# Altium schematic sheet HandTieSchematic.SchDoc
size A4
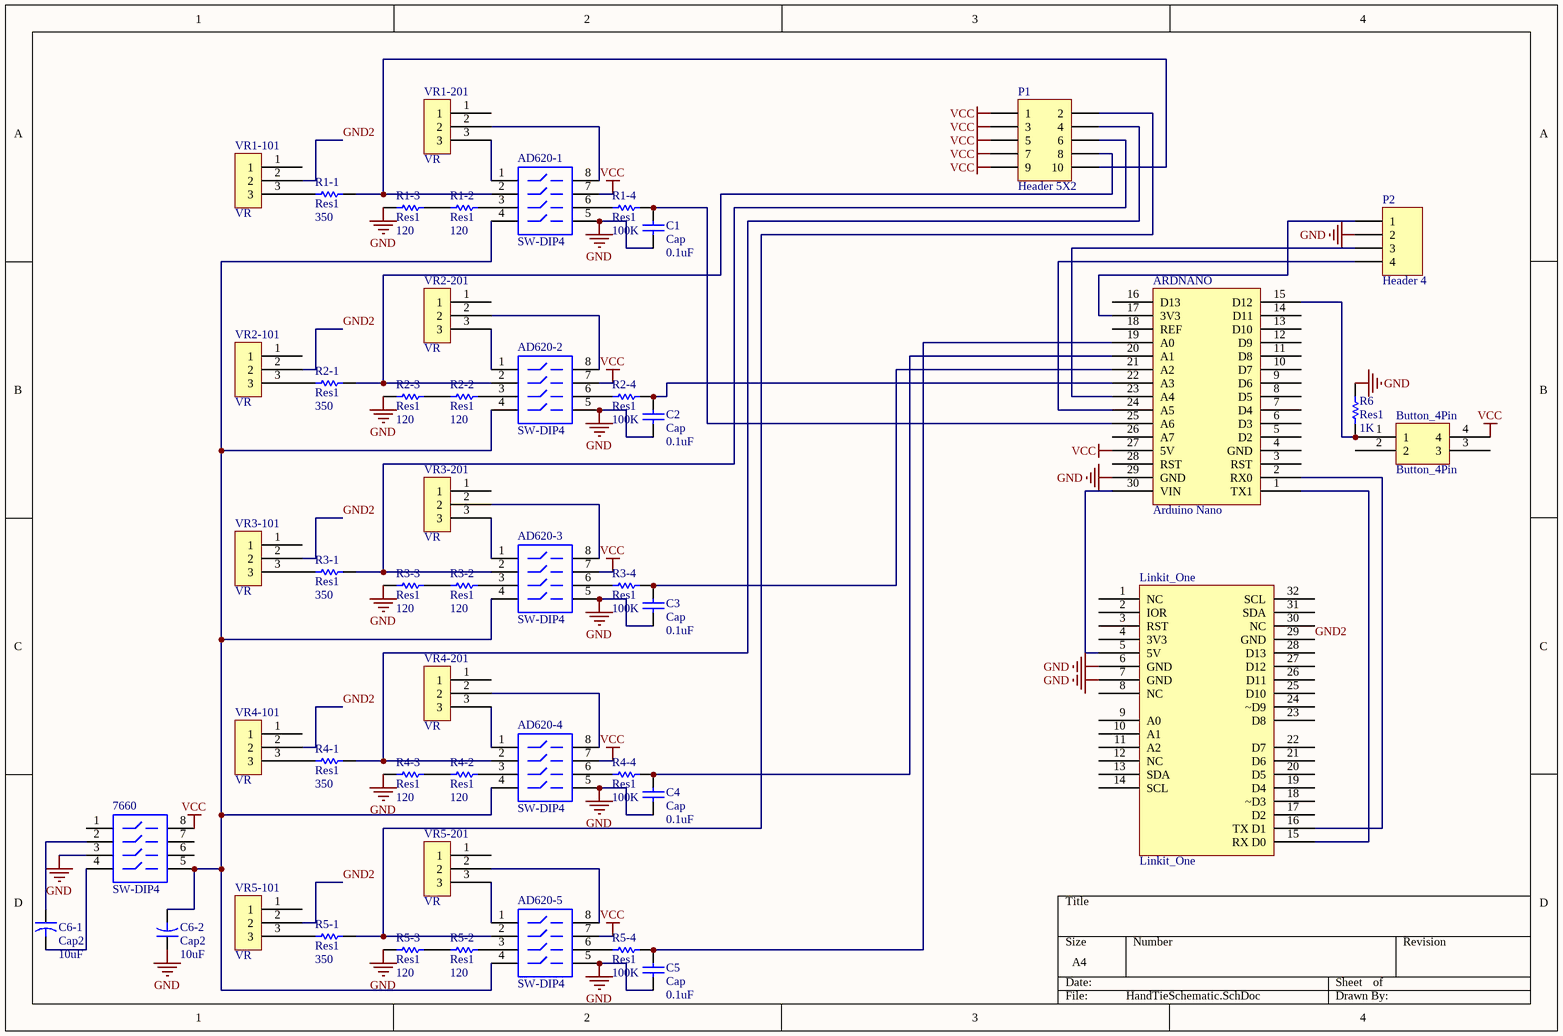
[diagram p0: HandTieSchematic.SchDoc]

## Parts
7660  SW-DIP4  [DIP-8]
AD620-1  SW-DIP4  [DIP-8]
AD620-2  SW-DIP4  [DIP-8]
AD620-3  SW-DIP4  [DIP-8]
AD620-4  SW-DIP4  [DIP-8]
AD620-5  SW-DIP4  [DIP-8]
ARDNANO  Arduino Nano  [ARDNANO_DIP30]
Button_4Pin  Button_4Pin  [Button_4Pin]
C1  Cap  value 0.1uF  [CAPR2.54-5.1x3.2]
C2  Cap  value 0.1uF  [CAPR2.54-5.1x3.2]
C3  Cap  value 0.1uF  [CAPR2.54-5.1x3.2]
C4  Cap  value 0.1uF  [CAPR2.54-5.1x3.2]
C5  Cap  value 0.1uF  [CAPR2.54-5.1x3.2]
C6-1  Cap2  value 10uF  [CAPR5-4X5]
C6-2  Cap2  value 10uF  [CAPR5-4X5]
Linkit_One  Linkit_One  [Linkit_One]
P1  Header 5X2  [HDR2X5]
P2  Header 4  [HDR1X4]
R1-1  Res1  value 350  [AXIAL-0.3]
R1-2  Res1  value 120  [AXIAL-0.3]
R1-3  Res1  value 120  [AXIAL-0.3]
R1-4  Res1  value 100K  [AXIAL-0.3]
R2-1  Res1  value 350  [AXIAL-0.3]
R2-2  Res1  value 120  [AXIAL-0.3]
R2-3  Res1  value 120  [AXIAL-0.3]
R2-4  Res1  value 100K  [AXIAL-0.3]
R3-1  Res1  value 350  [AXIAL-0.3]
R3-2  Res1  value 120  [AXIAL-0.3]
R3-3  Res1  value 120  [AXIAL-0.3]
R3-4  Res1  value 100K  [AXIAL-0.3]
R4-1  Res1  value 350  [AXIAL-0.3]
R4-2  Res1  value 120  [AXIAL-0.3]
R4-3  Res1  value 120  [AXIAL-0.3]
R4-4  Res1  value 100K  [AXIAL-0.3]
R5-1  Res1  value 350  [AXIAL-0.3]
R5-2  Res1  value 120  [AXIAL-0.3]
R5-3  Res1  value 120  [AXIAL-0.3]
R5-4  Res1  value 100K  [AXIAL-0.3]
R6  Res1  value 1K  [AXIAL-0.3]
VR1-101  VR  [VarResistor]
VR1-201  VR  [VarResistor]
VR2-101  VR  [VarResistor]
VR2-201  VR  [VarResistor]
VR3-101  VR  [VarResistor]
VR3-201  VR  [VarResistor]
VR4-101  VR  [VarResistor]
VR4-201  VR  [VarResistor]
VR5-101  VR  [VarResistor]
VR5-201  VR  [VarResistor]

## Nets
GND: 7660.3 AD620-1.5 AD620-2.5 AD620-3.5 AD620-4.5 AD620-5.5 ARDNANO.29(GND) C1.2 C2.2 C3.2 C4.2 C5.2 C6-2.1 Linkit_One.6(GND) Linkit_One.7(GND) P2.2 R1-3.1 R2-3.1 R3-3.1 R4-3.1 R5-3.1 R6.2
VCC: 7660.8 AD620-1.7 AD620-2.7 AD620-3.7 AD620-4.7 AD620-5.7 ARDNANO.27(5V) Button_4Pin.4 P1.1 P1.3 P1.5 P1.7 P1.9
GND2: Linkit_One.29(GND) VR1-101.2 VR2-101.2 VR3-101.2 VR4-101.2 VR5-101.2
Net7660_2: 7660.2 C6-1.1
Net7660_4: 7660.4 C6-1.2
Net7660_5: 7660.5 AD620-1.4 AD620-2.4 AD620-3.4 AD620-4.4 AD620-5.4 C6-2.2
NetAD620-1_1: AD620-1.1 VR1-201.3
NetAD620-1_2: AD620-1.2 P1.10 R1-1.2
NetAD620-1_3: AD620-1.3 R1-2.2
NetAD620-1_6: AD620-1.6 R1-4.2
NetAD620-1_8: AD620-1.8 VR1-201.2
NetAD620-2_1: AD620-2.1 VR2-201.3
NetAD620-2_2: AD620-2.2 P1.8 R2-1.2
NetAD620-2_3: AD620-2.3 R2-2.2
NetAD620-2_6: AD620-2.6 R2-4.2
NetAD620-2_8: AD620-2.8 VR2-201.2
NetAD620-3_1: AD620-3.1 VR3-201.3
NetAD620-3_2: AD620-3.2 P1.6 R3-1.2
NetAD620-3_3: AD620-3.3 R3-2.2
NetAD620-3_6: AD620-3.6 R3-4.2
NetAD620-3_8: AD620-3.8 VR3-201.2
NetAD620-4_1: AD620-4.1 VR4-201.3
NetAD620-4_2: AD620-4.2 P1.4 R4-1.2
NetAD620-4_3: AD620-4.3 R4-2.2
NetAD620-4_6: AD620-4.6 R4-4.2
NetAD620-4_8: AD620-4.8 VR4-201.2
NetAD620-5_1: AD620-5.1 VR5-201.3
NetAD620-5_2: AD620-5.2 P1.2 R5-1.2
NetAD620-5_3: AD620-5.3 R5-2.2
NetAD620-5_6: AD620-5.6 R5-4.2
NetAD620-5_8: AD620-5.8 VR5-201.2
NetARDNANO_1: ARDNANO.1(TX1) Linkit_One.15(RX_D0)
NetARDNANO_2: ARDNANO.2(RX0) Linkit_One.16(TX_D1)
NetARDNANO_15: ARDNANO.15(D12) Button_4Pin.1 R6.1
NetARDNANO_17: ARDNANO.17(3V3) P2.1
NetARDNANO_19: ARDNANO.19(A0) C5.1 R5-4.1
NetARDNANO_20: ARDNANO.20(A1) C4.1 R4-4.1
NetARDNANO_21: ARDNANO.21(A2) C3.1 R3-4.1
NetARDNANO_22: ARDNANO.22(A3) C2.1 R2-4.1
NetARDNANO_23: ARDNANO.23(A4) P2.3
NetARDNANO_24: ARDNANO.24(A5) P2.4
NetARDNANO_25: ARDNANO.25(A6) C1.1 R1-4.1
NetARDNANO_30: ARDNANO.30(VIN) Linkit_One.5(5V)
NetR1-1_1: R1-1.1 VR1-101.3
NetR1-2_1: R1-2.1 R1-3.2
NetR2-1_1: R2-1.1 VR2-101.3
NetR2-2_1: R2-2.1 R2-3.2
NetR3-1_1: R3-1.1 VR3-101.3
NetR3-2_1: R3-2.1 R3-3.2
NetR4-1_1: R4-1.1 VR4-101.3
NetR4-2_1: R4-2.1 R4-3.2
NetR5-1_1: R5-1.1 VR5-101.3
NetR5-2_1: R5-2.1 R5-3.2

Not connected (* = marked no-connect by the designer): 7660 1 6 7; ARDNANO 3(RST) 4(GND) 5(D2) 6(D3) 7(D4) 8(D5) 9(D6) 10(D7) 11(D8) 12(D9) 13(D10) 14(D11) 16(D13) 18(REF) 26(A7) 28(RST); Button_4Pin 2 3; Linkit_One 1(NC) 2(IOR) 3(RST) 4(3V3) 8(NC) 9(A0) 10(A1) 11(A2) 12(NC) 13(SDA) 14(SCL) 17(D2) 18(~D3) 19(D4) 20(D5) 21(D6) 22(D7) 23(D8) 24(~D9) 25(D10) 26(D11) 27(D12) 28(D13) 30(NC) 31(SDA) 32(SCL); VR1-101 1; VR1-201 1; VR2-101 1; VR2-201 1; VR3-101 1; VR3-201 1; VR4-101 1; VR4-201 1; VR5-101 1; VR5-201 1

## Library data of the parts
7660 AD620-1-AD620-5 = SW-DIP4: DIP Switch; Published: 24-Mar-1999; LatestRevisionDate: 17-Jul-2002; LatestRevisionNote: Re-released for DXP Platform.; PackageReference: DIP-8; Publisher: Altium Limited
C1-C5 = Cap: Capacitor; Published: 8-Jun-2000; LatestRevisionDate: 17-Jul-2002; LatestRevisionNote: Re-released for DXP Platform.; PackageReference: RAD-0.3; Publisher: Altium Limited
C6-1 C6-2 = Cap2: Capacitor; Published: 23-Sep-2002; PackageReference: CAPR5-4X5; Publisher: Altium Limited
P1 = Header 5X2: Header, 5-Pin, Dual row; LatestRevisionDate: 17-Jul-2002; LatestRevisionNote: Re-released for DXP Platform.; Publisher: Altium Limited
P2 = Header 4: Header, 4-Pin; LatestRevisionDate: 17-Jul-2002; LatestRevisionNote: Re-released for DXP Platform.; Publisher: Altium Limited
R1-1-R1-4 R2-1-R2-4 R3-1-R3-4 R4-1-R4-4 R5-1-R5-4 R6 = Res1: Resistor; Published: 8-Jun-2000; LatestRevisionDate: 17-Jul-2002; LatestRevisionNote: Re-released for DXP Platform.; PackageReference: AXIAL-0.3; Publisher: Altium Limited
VR1-101 VR1-201 VR2-101 VR2-201 VR3-101 VR3-201 VR4-101 VR4-201 VR5-101 VR5-201 = VarR